# EAGLE design PowanPowan (EAGLE 7.1.0)
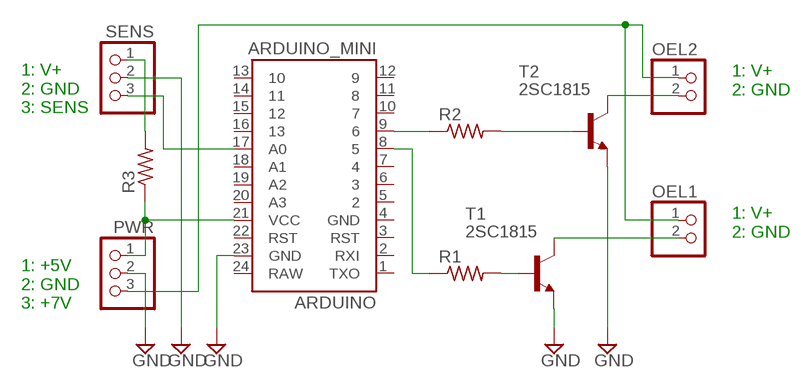
[diagram p0: schematic, sheet 1]

## Parts
ARDUINO  ARDUINO_MINI  [ARDUINO_MINI]
OEL1  PINHD-1X2  [1X02]
OEL2  PINHD-1X2  [1X02]
PWR  PINHD-1X3  [1X03]
R1  R-US_0204/7  [0204/7]
R2  R-US_0204/7  [0204/7]
R3  R-US_0204/7  [0204/7]
SENS  PINHD-1X3  [1X03]
T1  2SC1815  [TO92-ECB]
T2  2SC1815  [TO92-ECB]

## Nets
GND: ARDUINO.23(GND) PWR.2 SENS.2 T1.E T2.E
N$1: ARDUINO.8 R1.1
N$2: ARDUINO.9 R2.1
N$3: ARDUINO.21(VCC) PWR.1 R3.1
N$4: R2.2 T2.B
N$5: R1.2 T1.B
N$6: OEL1.2 T1.C
N$7: OEL2.2 T2.C
N$8: OEL1.1 OEL2.1 PWR.3
N$9: R3.2 SENS.1
N$11: ARDUINO.17(A0) SENS.3
Unconnected: ARDUINO.1(TXO) ARDUINO.2(RXI) ARDUINO.3(RST) ARDUINO.4(GND) ARDUINO.5 ARDUINO.6 ARDUINO.7 ARDUINO.10 ARDUINO.11 ARDUINO.12 ARDUINO.13 ARDUINO.14 ARDUINO.15 ARDUINO.16 ARDUINO.18(A1) ARDUINO.19(A2) ARDUINO.20(A3) ARDUINO.22(RST) ARDUINO.24(RAW)

## Notes on the sheet
- 1: V+
  2: GND
- 1: V+
  2: GND
  3: SENS
- 1: V+
  2: GND
- 1: +5V
  2: GND
  3: +7V

## Library data of the parts
ARDUINO = SparkFun-Boards:ARDUINO_MINI: Arduino Pro Mini footprint
OEL1 OEL2 = pinhead:PINHD-1X2: PIN HEADER
PWR SENS = pinhead:PINHD-1X3: PIN HEADER
R1-R3 = resistor:R-US_: RESISTOR, American symbol
T1 T2 = transistor:2SC1815: NPN EPITAXIAL TRANSISTOR Source: TOSHIBA .. 2SC1815 1.pdf

## Board
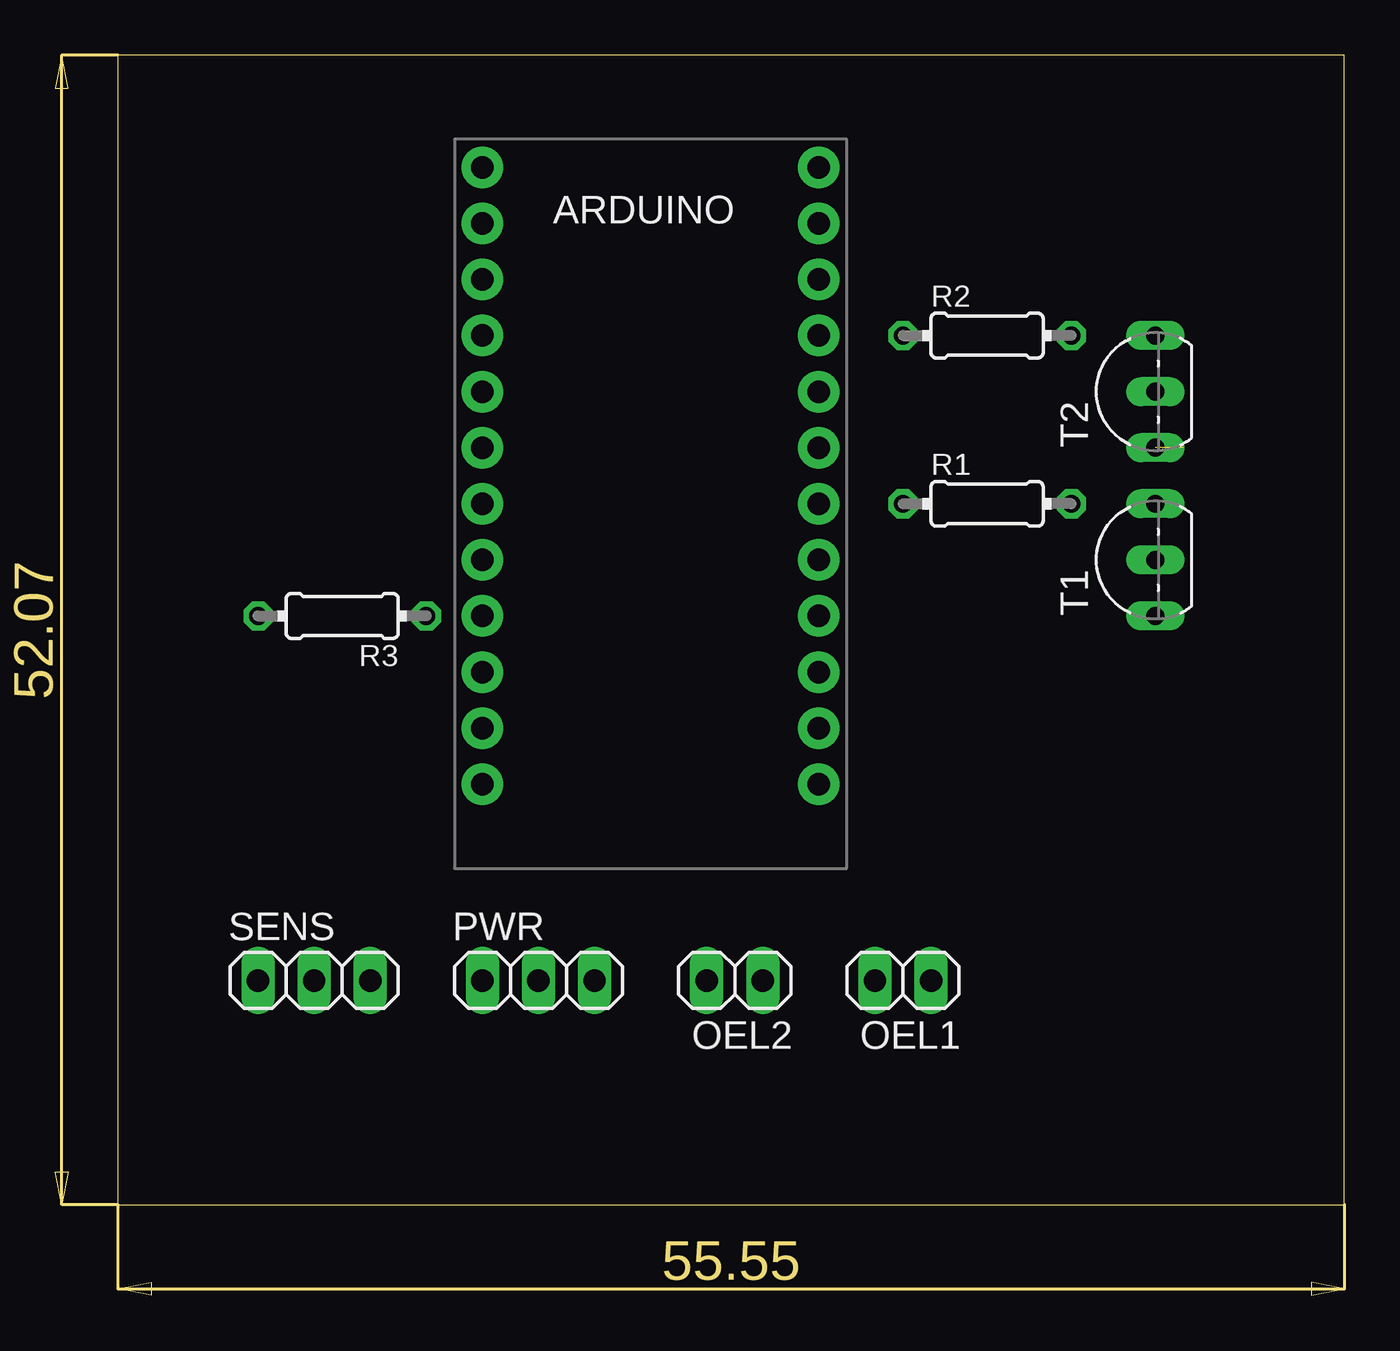
[diagram p1: board, top side]
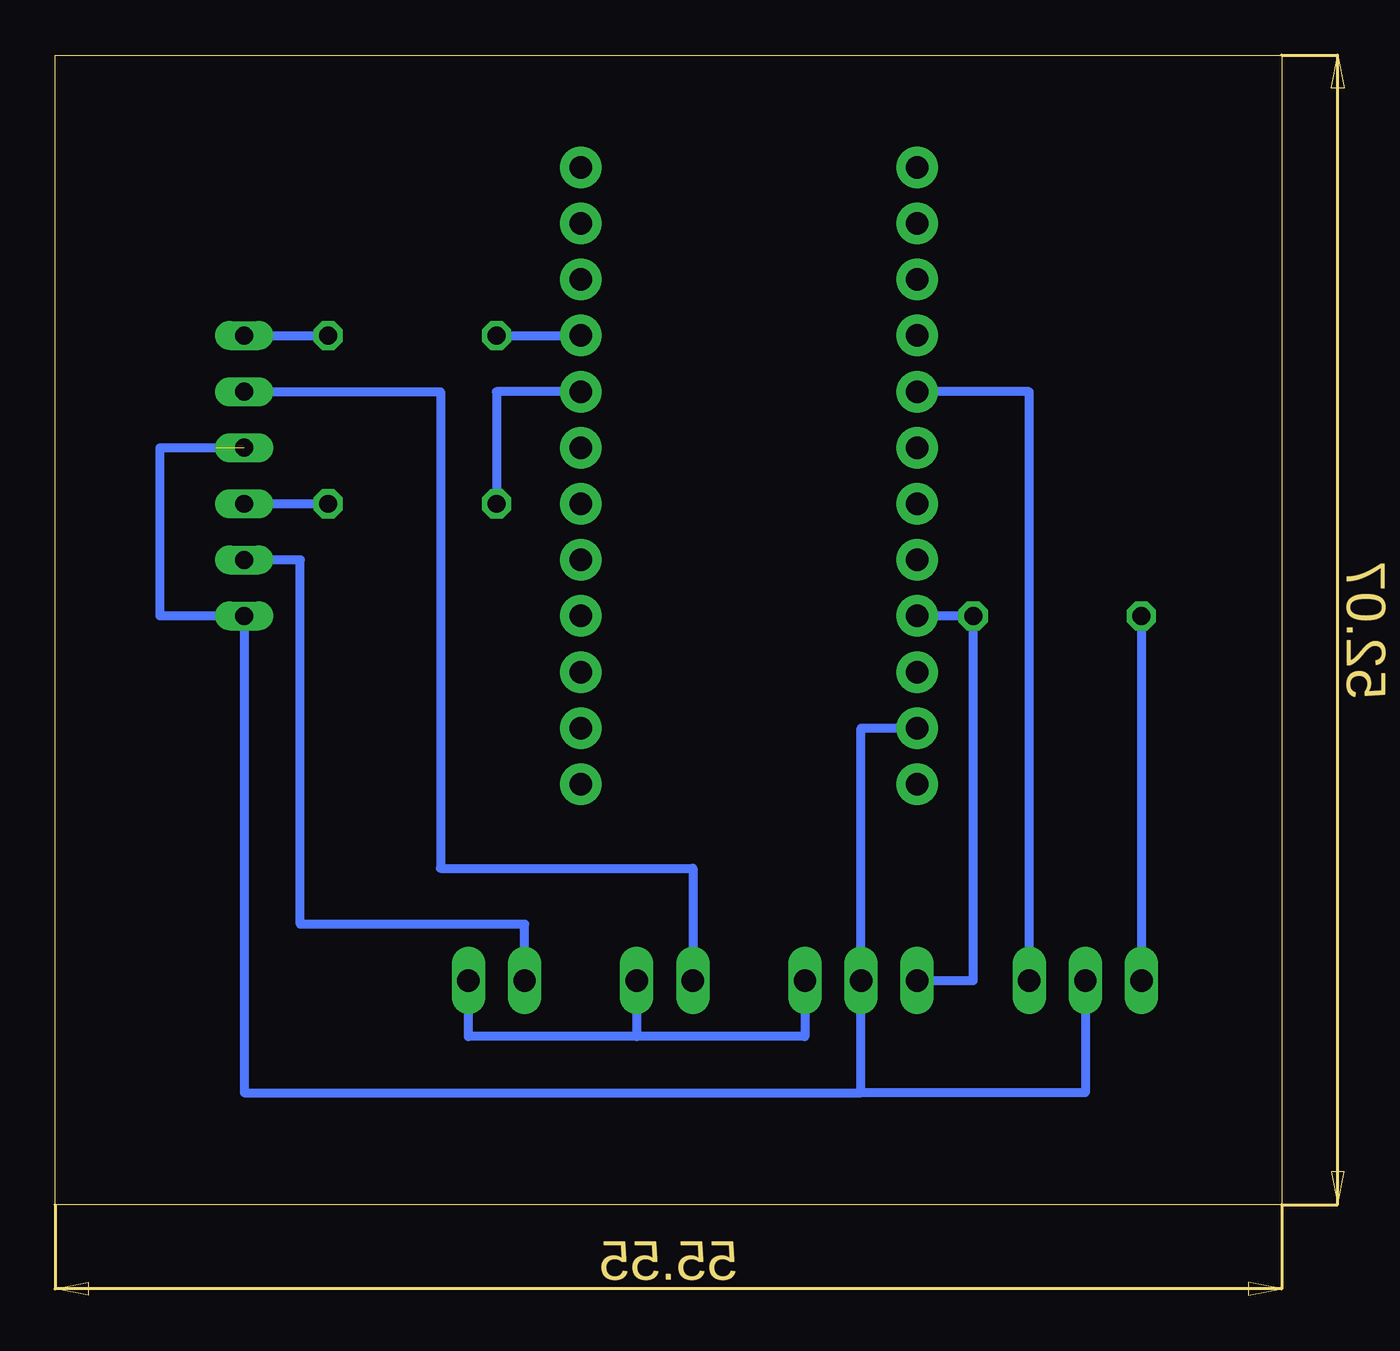
[diagram p2: board, bottom side, seen from below]

Size 55.55 x 52.06 mm. Coordinates in mm from the lower left corner, seen from the top.
Outline: 0,0 55.55,0 55.55,52.06 0,52.06 0,0
Copper layers (1*16): Top 0.035mm / dielectric 1.5mm / Bottom 0.035mm
Design rules "default": minimum track width 10mil, minimum drill 24mil, track to track 8mil, track to pad 8mil, pad to pad 8mil, via to via 8mil, smd to smd 8mil, copper to edge 40mil, drill to drill 8mil, minimum pad ring 10mil, minimum via ring 8mil, stop-mask expansion 4mil, vias tented up to drill 0mil, thermal gap 10mil

### Footprints (pad centres in the part's own frame; a part is rotated, then mirrored left to right if it is on the bottom)
ARDUINO_MINI = drill 1.016 pad 1.88: 1 -7.62,12.7; 2 -7.62,10.16; 3 -7.62,7.62; 4 -7.62,5.08; 5 -7.62,2.54; 6 -7.62,0; 7 -7.62,-2.54; 8 -7.62,-5.08; 9 -7.62,-7.62; 10 -7.62,-10.16; 11 -7.62,-12.7; 12 -7.62,-15.24; 13 7.62,-15.24; 14 7.62,-12.7; 15 7.62,-10.16; 16 7.62,-7.62; 17 7.62,-5.08; 18 7.62,-2.54; 19 7.62,0; 20 7.62,2.54; 21 7.62,5.08; 22 7.62,7.62; 23 7.62,10.16; 24 7.62,12.7
1X02 = drill 1.016 long: 1 -1.27,0; 2 1.27,0
1X03 = drill 1.016 long: 1 -2.54,0; 2 0,0; 3 2.54,0
0204/7 = drill 0.813 octagon: 1 -3.81,0; 2 3.81,0
TO92-ECB = drill 0.813 long: B 2.54,0; C 0,0; E -2.54,0

### Placement (x,y rotation side)
ARDUINO  24.13,31.75 180 top
OEL1  35.56,10.16 180 top
OEL2  27.94,10.16 180 top
PWR  19.05,10.16 0 top
R1  39.37,31.75 0 top
R2  39.37,39.37 0 top
R3  10.16,26.67 180 top
SENS  8.89,10.16 0 top
T1  46.99,29.21 90 top
T2  46.99,36.83 90 top

### Tracks (layer width: path | path; a pad name or v marks a point on that pad's centre or on a via)
GND  (1 unrouted)
  Bottom 0.406: ARDUINO.23 19.05,21.59 PWR.2 19.05,5.08 | 48.26,34.29 50.8,34.29 50.8,26.67 T1.E 46.99,5.08 19.05,5.08 | SENS.2 8.89,5.08 19.05,5.08
N$1
  Bottom 0.406: ARDUINO.8 35.56,36.83 R1.1
N$2
  Bottom 0.406: R2.1 ARDUINO.9
N$3
  Bottom 0.406: PWR.1 13.97,10.16 R3.1 ARDUINO.21
N$4
  Bottom 0.406: T2.B R2.2
N$5
  Bottom 0.406: T1.B R1.2
N$6
  Bottom 0.406: OEL1.2 34.29,12.7 44.45,12.7 44.45,29.21 T1.C
N$7
  Bottom 0.406: T2.C 38.1,36.83 38.1,15.24 26.67,15.24 OEL2.2
N$8
  Bottom 0.406: PWR.3 21.59,7.62 29.21,7.62 | OEL2.1 29.21,7.62 | 29.21,7.62 36.83,7.62 OEL1.1
N$9
  Bottom 0.406: R3.2 SENS.1
N$11
  Bottom 0.406: SENS.3 11.43,36.83 ARDUINO.17